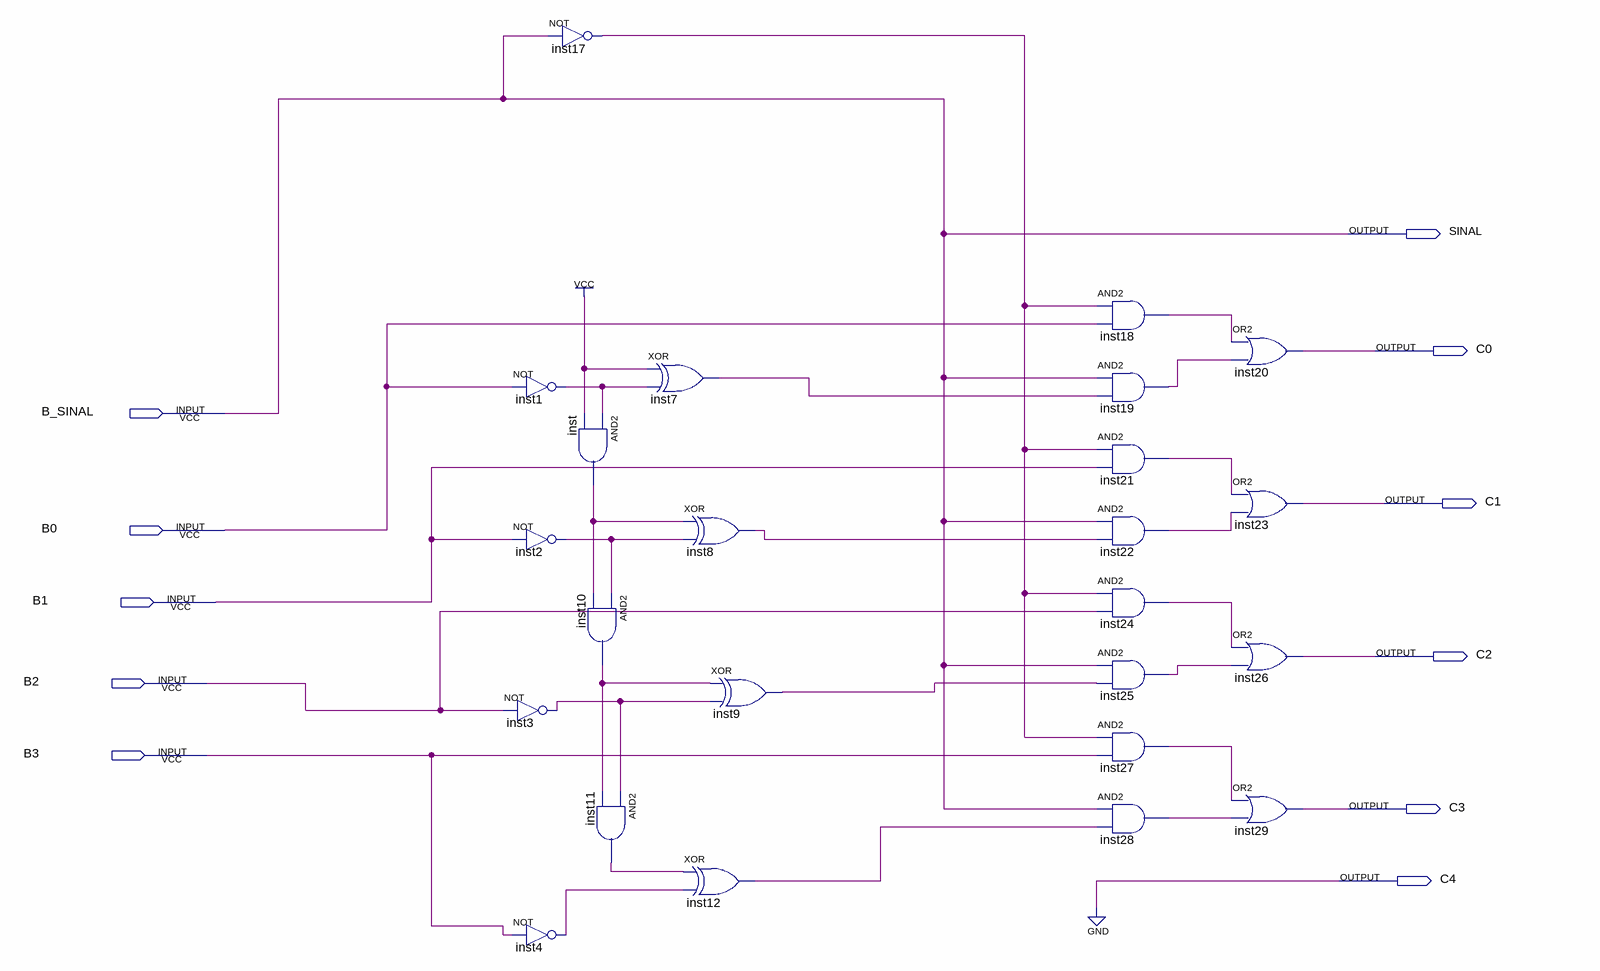
[diagram p0: schematic sheet]
// Quartus schematic Complemento2.bdf as structural Verilog: 24 symbols, 11 pins
module Complemento2 (
  input  B_SINAL,
  input  B0,
  input  B1,
  input  B2,
  input  B3,
  output SINAL,
  output C0,
  output C1,
  output C2,
  output C3,
  output C4
);

  wire inst1_out, inst2_out, inst3_out, inst4_out, inst7_out, inst8_out, inst9_out, inst10_out, inst11_out,
       inst12_out, inst17_out, inst18_out, inst19_out, inst21_out, inst22_out, inst24_out, inst25_out,
       inst27_out, inst28_out, inst_out;

  not inst1 (inst1_out, B0);
  not inst2 (inst2_out, B1);
  not inst3 (inst3_out, B2);
  not inst4 (inst4_out, B3);
  not inst17 (inst17_out, B_SINAL);
  and inst (inst_out, inst1_out, 1'b1);
  and inst10 (inst10_out, inst2_out, inst_out);
  and inst11 (inst11_out, inst3_out, inst10_out);
  xor inst7 (inst7_out, 1'b1, inst1_out);
  xor inst8 (inst8_out, inst_out, inst2_out);
  xor inst9 (inst9_out, inst10_out, inst3_out);
  xor inst12 (inst12_out, inst11_out, inst4_out);
  and inst18 (inst18_out, inst17_out, B0);
  and inst19 (inst19_out, B_SINAL, inst7_out);
  and inst21 (inst21_out, inst17_out, B1);
  and inst22 (inst22_out, B_SINAL, inst8_out);
  and inst24 (inst24_out, inst17_out, B2);
  and inst25 (inst25_out, B_SINAL, inst9_out);
  and inst27 (inst27_out, inst17_out, B3);
  and inst28 (inst28_out, B_SINAL, inst12_out);
  or inst20 (C0, inst18_out, inst19_out);
  or inst23 (C1, inst21_out, inst22_out);
  or inst26 (C2, inst24_out, inst25_out);
  or inst29 (C3, inst27_out, inst28_out);

  assign C4 = 1'b0;
  assign SINAL = B_SINAL;
endmodule
